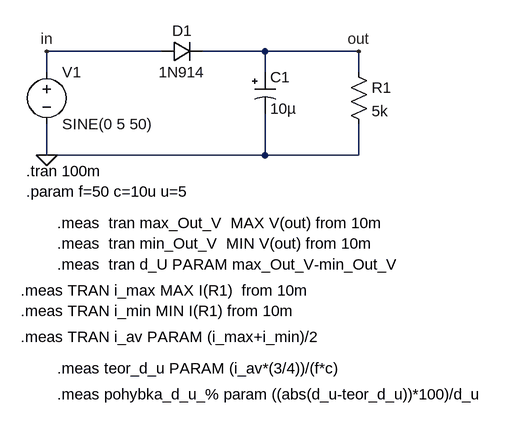
[diagram p0: schematic 1_Однонапівперіодний випрямляч.asc]
1_Однонапівперіодний випрямляч.asc, the LTspice schematic file:
Version 4
SHEET 1 880 824
WIRE -240 224 -416 224
WIRE -80 224 -176 224
WIRE 64 224 -80 224
WIRE -416 256 -416 224
WIRE -80 256 -80 224
WIRE 64 256 64 224
WIRE -416 384 -416 336
WIRE -80 384 -80 320
WIRE -80 384 -416 384
WIRE 64 384 64 336
WIRE 64 384 -80 384
FLAG -416 384 0
FLAG 64 224 out
FLAG -416 224 in
SYMBOL res 48 240 R0
SYMATTR InstName R1
SYMATTR Value 5k
SYMBOL diode -240 240 R270
WINDOW 0 32 32 VTop 2
WINDOW 3 0 32 VBottom 2
SYMATTR InstName D1
SYMATTR Value 1N914
SYMBOL polcap -96 256 R0
WINDOW 3 24 56 Left 2
SYMATTR Value 10µ
SYMATTR InstName C1
SYMATTR Description Capacitor
SYMATTR Type cap
SYMATTR SpiceLine V=16 Irms=3.72678 Rser=0.018 Lser=0
SYMBOL voltage -416 240 R0
WINDOW 123 0 0 Left 2
WINDOW 39 0 0 Left 2
SYMATTR InstName V1
SYMATTR Value SINE(0 5 50)
TEXT -448 408 Left 2 !.tran 100m
TEXT -400 488 Left 2 !.meas  tran max_Out_V  MAX V(out) from 10m
TEXT -400 520 Left 2 !.meas  tran min_Out_V  MIN V(out) from 10m
TEXT -400 552 Left 2 !.meas  tran d_U PARAM max_Out_V-min_Out_V
TEXT -448 440 Left 2 !.param f=50 c=10u u=5
TEXT -456 592 Left 2 !.meas TRAN i_max MAX I(R1)  from 10m
TEXT -456 624 Left 2 !.meas TRAN i_min MIN I(R1) from 10m
TEXT -456 664 Left 2 !.meas TRAN i_av PARAM (i_max+i_min)/2
TEXT -400 712 Left 2 !.meas teor_d_u PARAM (i_av*(3/4))/(f*c)
TEXT -400 752 Left 2 !.meas pohybka_d_u_% param ((abs(d_u-teor_d_u))*100)/d_u

The netlist it stands for:
* 1_Однонапівперіодний випрямляч.asc
R1 out 0 5k
D1 in out 1N914
C1 out 0 10µ V=16 Irms=3.72678 Rser=0.018 Lser=0
V1 in 0 SINE(0 5 50)
.model D D
.lib standard.dio
.tran 100m
.meas  tran max_Out_V  MAX V(out) from 10m
.meas  tran min_Out_V  MIN V(out) from 10m
.meas  tran d_U PARAM max_Out_V-min_Out_V
.param f=50 c=10u u=5
.meas TRAN i_max MAX I(R1)  from 10m
.meas TRAN i_min MIN I(R1) from 10m
.meas TRAN i_av PARAM (i_max+i_min)/2
.meas teor_d_u PARAM (i_av*(3/4))/(f*c)
.meas pohybka_d_u_% param ((abs(d_u-teor_d_u))*100)/d_u
.backanno
.end